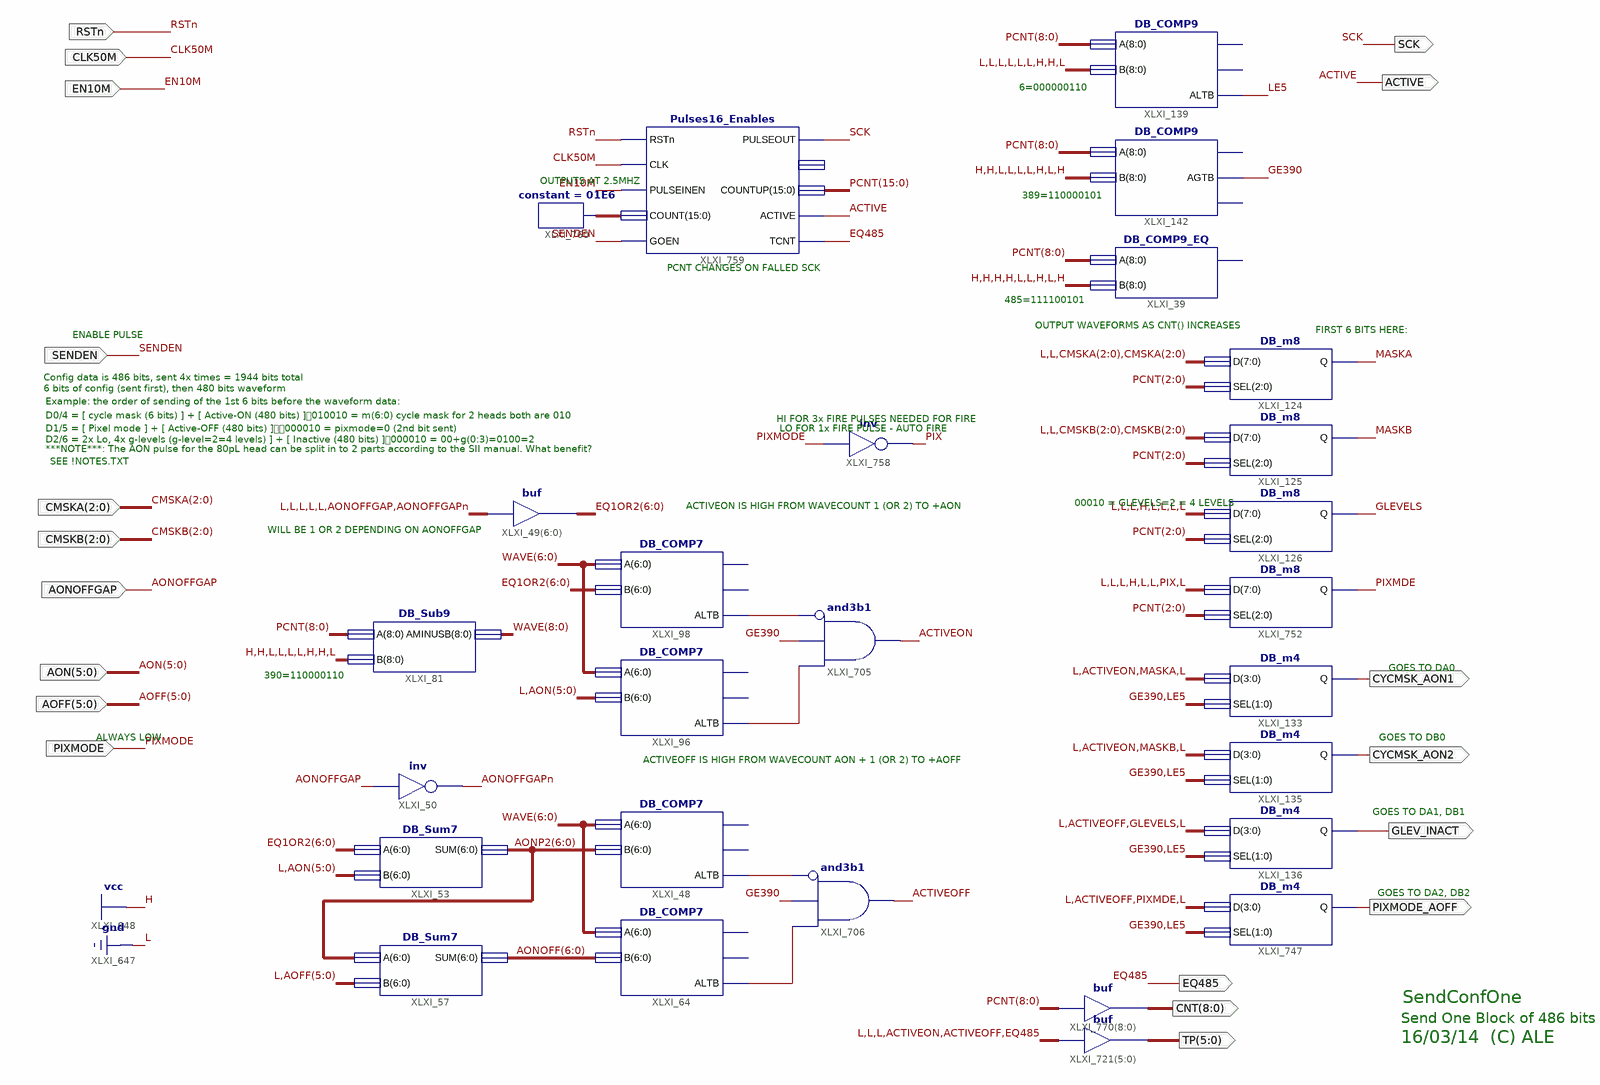
[diagram p0: schematic sheet 1]
// Xilinx ISE schematic DB_SendConfOne.sch (spartan3e) as structural Verilog: 27 symbols, 19 ports
module DB_SendConfOne (
  input  RSTn,
  input  AONOFFGAP,
  input  [5:0] AOFF,
  input  [5:0] AON,
  input  [2:0] CMSKA,
  input  [2:0] CMSKB,
  input  PIXMODE,
  input  CLK50M,
  input  EN10M,
  input  SENDEN,
  output ACTIVE,
  output SCK,
  output EQ485,
  output [5:0] TP,
  output GLEV_INACT,
  output CYCMSK_AON2,
  output CYCMSK_AON1,
  output PIXMODE_AOFF,
  output [8:0] CNT
);

  wire ACTIVEOFF, ACTIVEON, AONOFFGAPn, GE390, GLEVELS, LE5, MASKA, MASKB, PIX, PIXMDE, XLXN_181, XLXN_260,
       XLXN_262, XLXN_718;
  wire [6:0] AONOFF, AONP2, EQ1OR2;
  wire [8:0] WAVE;
  wire [15:0] PCNT, XLXN_722;

  DB_COMP9 XLXI_139 (.A(PCNT[8:0]), .ALTB(LE5), .B(9'b000000110));  // open: AGTB, EQ
  DB_COMP9 XLXI_142 (.A(PCNT[8:0]), .AGTB(GE390), .B(9'b110000101));  // open: ALTB, EQ
  DB_COMP9_EQ XLXI_39 (.A(PCNT[8:0]), .B(9'b111100101));  // open: EQ
  DB_Sum7 XLXI_53 (.A(EQ1OR2), .B({1'b0, AON}), .SUM(AONP2));
  DB_COMP7 XLXI_48 (.A(WAVE[6:0]), .ALTB(XLXN_718), .B(AONP2));  // open: AGTB, EQ
  DB_Sum7 XLXI_57 (.A(AONP2), .B({1'b0, AOFF}), .SUM(AONOFF));
  DB_COMP7 XLXI_64 (.A(WAVE[6:0]), .ALTB(XLXN_181), .B(AONOFF));  // open: AGTB, EQ
  not XLXI_50 (AONOFFGAPn, AONOFFGAP);
  DB_COMP7 XLXI_96 (.A(WAVE[6:0]), .ALTB(XLXN_262), .B({1'b0, AON}));  // open: AGTB, EQ
  DB_COMP7 XLXI_98 (.A(WAVE[6:0]), .ALTB(XLXN_260), .B(EQ1OR2));  // open: AGTB, EQ
  assign EQ1OR2 = {{5{1'b0}}, AONOFFGAP, AONOFFGAPn};  // buf XLXI_49[6..0], 7 bits wide
  and XLXI_705 (ACTIVEON, ~XLXN_260, GE390, XLXN_262);  // and3b1
  and XLXI_706 (ACTIVEOFF, ~XLXN_718, GE390, XLXN_181);  // and3b1
  assign TP = {3'b000, ACTIVEON, ACTIVEOFF, EQ485};  // buf XLXI_721[5..0], 6 bits wide
  DB_m4 XLXI_136 (.D({1'b0, ACTIVEOFF, GLEVELS, 1'b0}), .Q(GLEV_INACT), .SEL({GE390, LE5}));
  DB_m4 XLXI_135 (.D({1'b0, ACTIVEON, MASKB, 1'b0}), .Q(CYCMSK_AON2), .SEL({GE390, LE5}));
  DB_m4 XLXI_133 (.D({1'b0, ACTIVEON, MASKA, 1'b0}), .Q(CYCMSK_AON1), .SEL({GE390, LE5}));
  DB_m4 XLXI_747 (.D({1'b0, ACTIVEOFF, PIXMDE, 1'b0}), .Q(PIXMODE_AOFF), .SEL({GE390, LE5}));
  DB_m8 XLXI_124 (.D({2'b00, CMSKA, CMSKA}), .Q(MASKA), .SEL(PCNT[2:0]));
  DB_m8 XLXI_125 (.D({2'b00, CMSKB, CMSKB}), .Q(MASKB), .SEL(PCNT[2:0]));
  DB_m8 XLXI_126 (.D(8'b00010000), .Q(GLEVELS), .SEL(PCNT[2:0]));
  DB_m8 XLXI_752 (.D({6'b000100, PIX, 1'b0}), .Q(PIXMDE), .SEL(PCNT[2:0]));
  not XLXI_758 (PIX, PIXMODE);
  DB_Sub9 XLXI_81 (.A(PCNT[8:0]), .AMINUSB(WAVE), .B(9'b110000110));
  assign CNT = PCNT[8:0];  // buf XLXI_770[8..0], 9 bits wide
  constant #(.CValue("01E6")) XLXI_760 (.O(XLXN_722));
  Pulses16_Enables XLXI_759 (
    .ACTIVE(ACTIVE), .CLK(CLK50M), .COUNT(XLXN_722), .COUNTUP(PCNT), .GOEN(SENDEN), .PULSEINEN(EN10M),
    .PULSEOUT(SCK), .RSTn(RSTn), .TCNT(EQ485));  // open: PULSEOUTEN

  // Notes on the sheet:
  //   6=000000110
  //   OUTPUTS AT 2.5MHZ
  //   389=110000101
  //   PCNT CHANGES ON FALLED SCK
  //   485=111100101
  //   OUTPUT WAVEFORMS AS CNT() INCREASES
  //   FIRST 6 BITS HERE:
  //   ENABLE PULSE
  //   Config data is 486 bits, sent 4x times = 1944 bits total
  //   6 bits of config (sent first), then 480 bits waveform
  //   Example: the order of sending of the 1st 6 bits before the waveform data:
  //   D0/4 = [ cycle mask (6 bits) ] + [ Active-ON (480 bits) ]	010010 = m(6:0) cycle mask for 2 heads both are 010
  //   HI FOR 3x FIRE PULSES NEEDED FOR FIRE
  //   D1/5 = [ Pixel mode ] + [ Active-OFF (480 bits) ]		000010 = pixmode=0 (2nd bit sent)
  //   LO FOR 1x FIRE PULSE - AUTO FIRE
  //   D2/6 = 2x Lo, 4x g-levels (g-level=2=4 levels) ] + [ Inactive (480 bits) ]	000010 = 00+g(0:3)=0100=2
  //   ***NOTE***: The AON pulse for the 80pL head can be split in to 2 parts according to the SII manual. What benefit?
  //   SEE !NOTES.TXT
  //   00010 = GLEVELS=2 = 4 LEVELS
  //   ACTIVEON IS HIGH FROM WAVECOUNT 1 (OR 2) TO +AON
  //   WILL BE 1 OR 2 DEPENDING ON AONOFFGAP
  //   GOES TO DA0
  //   390=110000110
  //   ALWAYS LOW
  //   GOES TO DB0
  //   ACTIVEOFF IS HIGH FROM WAVECOUNT AON + 1 (OR 2) TO +AOFF
  //   GOES TO DA1, DB1
  //   GOES TO DA2, DB2
  //   SendConfOne
  //   Send One Block of 486 bits
  //   16/03/14  (C) ALE
endmodule
